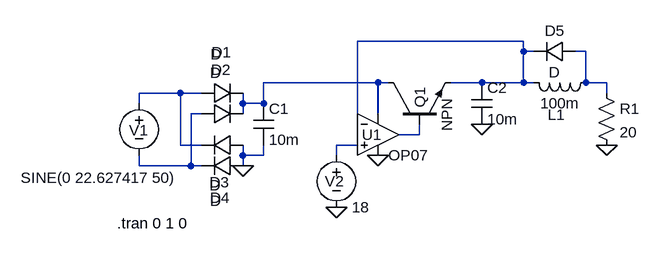
[diagram p0: schematic LinReg.asc]
LinReg.asc, the LTspice schematic file:
Version 4
SHEET 1 880 680
WIRE 624 0 368 0
WIRE 624 16 624 0
WIRE 640 16 624 16
WIRE 720 16 704 16
WIRE 400 64 224 64
WIRE 416 64 400 64
WIRE 560 64 512 64
WIRE 624 64 624 16
WIRE 624 64 560 64
WIRE 640 64 624 64
WIRE 720 64 720 16
WIRE 752 64 720 64
WIRE 96 80 32 80
WIRE 128 80 96 80
WIRE 752 80 752 64
WIRE 32 96 32 80
WIRE 192 96 192 80
WIRE 224 96 224 64
WIRE 224 96 192 96
WIRE 128 112 112 112
WIRE 192 112 192 96
WIRE 400 112 400 64
WIRE 368 128 368 0
WIRE 464 144 464 128
WIRE 464 144 432 144
WIRE 96 160 96 80
WIRE 128 160 96 160
WIRE 368 160 336 160
WIRE 192 176 192 160
WIRE 224 176 224 160
WIRE 224 176 192 176
WIRE 336 176 336 160
WIRE 32 192 32 176
WIRE 112 192 112 112
WIRE 112 192 32 192
WIRE 128 192 112 192
WIRE 192 192 192 176
FLAG 400 176 0
FLAG 192 192 0
FLAG 752 160 0
FLAG 336 256 0
FLAG 560 128 0
SYMBOL voltage 32 80 R0
WINDOW 0 -15 57 Left 2
WINDOW 3 -182 130 Left 2
WINDOW 123 0 0 Left 0
WINDOW 39 0 0 Left 0
SYMATTR InstName V1
SYMATTR Value SINE(0 22.627417 50)
SYMBOL diode 128 96 R270
WINDOW 0 63 31 VTop 2
WINDOW 3 91 23 VBottom 2
SYMATTR InstName D1
SYMBOL diode 128 128 R270
WINDOW 0 68 30 VTop 2
WINDOW 3 95 22 VBottom 2
SYMATTR InstName D2
SYMBOL diode 192 144 R90
WINDOW 0 89 36 VBottom 2
WINDOW 3 86 42 VTop 2
SYMATTR InstName D3
SYMBOL diode 192 176 R90
WINDOW 0 81 35 VBottom 2
WINDOW 3 30 43 VTop 2
SYMATTR InstName D4
SYMBOL cap 208 96 R0
SYMATTR InstName C1
SYMATTR Value 10m
SYMBOL npn 416 128 R270
WINDOW 0 25 49 Left 2
WINDOW 3 -11 90 Left 2
SYMATTR InstName Q1
SYMBOL Opamps\\OP07 400 80 R0
WINDOW 0 -25 64 Left 2
SYMATTR InstName U1
SYMBOL res 736 64 R0
SYMATTR InstName R1
SYMATTR Value 20
SYMBOL voltage 336 160 R0
WINDOW 0 -18 56 Left 2
WINDOW 123 0 0 Left 0
WINDOW 39 0 0 Left 0
SYMATTR InstName V2
SYMATTR Value 18
SYMBOL cap 544 64 R0
SYMATTR InstName C2
SYMATTR Value 10m
SYMBOL ind 736 48 R90
WINDOW 0 81 61 VBottom 2
WINDOW 3 32 56 VTop 2
SYMATTR InstName L1
SYMATTR Value 100m
SYMBOL diode 704 0 R90
WINDOW 0 0 32 VBottom 2
WINDOW 3 32 32 VTop 2
SYMATTR InstName D5
TEXT -2 280 Left 2 !.tran 0 1 0

The netlist it stands for:
* LinReg.asc
V1 N004 N005 SINE(0 22.627417 50)
D1 N004 N003 D
D2 N005 N003 D
D3 0 N004 D
D4 0 N005 D
C1 N003 0 10m
Q1 N003 N006 N001 0 NPN
XU1 N007 N001 N003 0 N006 LT1001  ; OP07, pins In+ In- V+ V- OUT
R1 N002 0 20
V2 N007 0 18
C2 N001 0 10m
L1 N002 N001 100m
D5 N002 N001 D
.model D D
.lib standard.dio
.model NPN NPN
.model PNP PNP
.lib standard.bjt
.tran 0 1 0
.lib LTC.lib
.backanno
.end